# Altium schematic sheet SAMA7D65_DDR3L.SchDoc
size A3; SheetNumber: 9; SheetTotal: 23
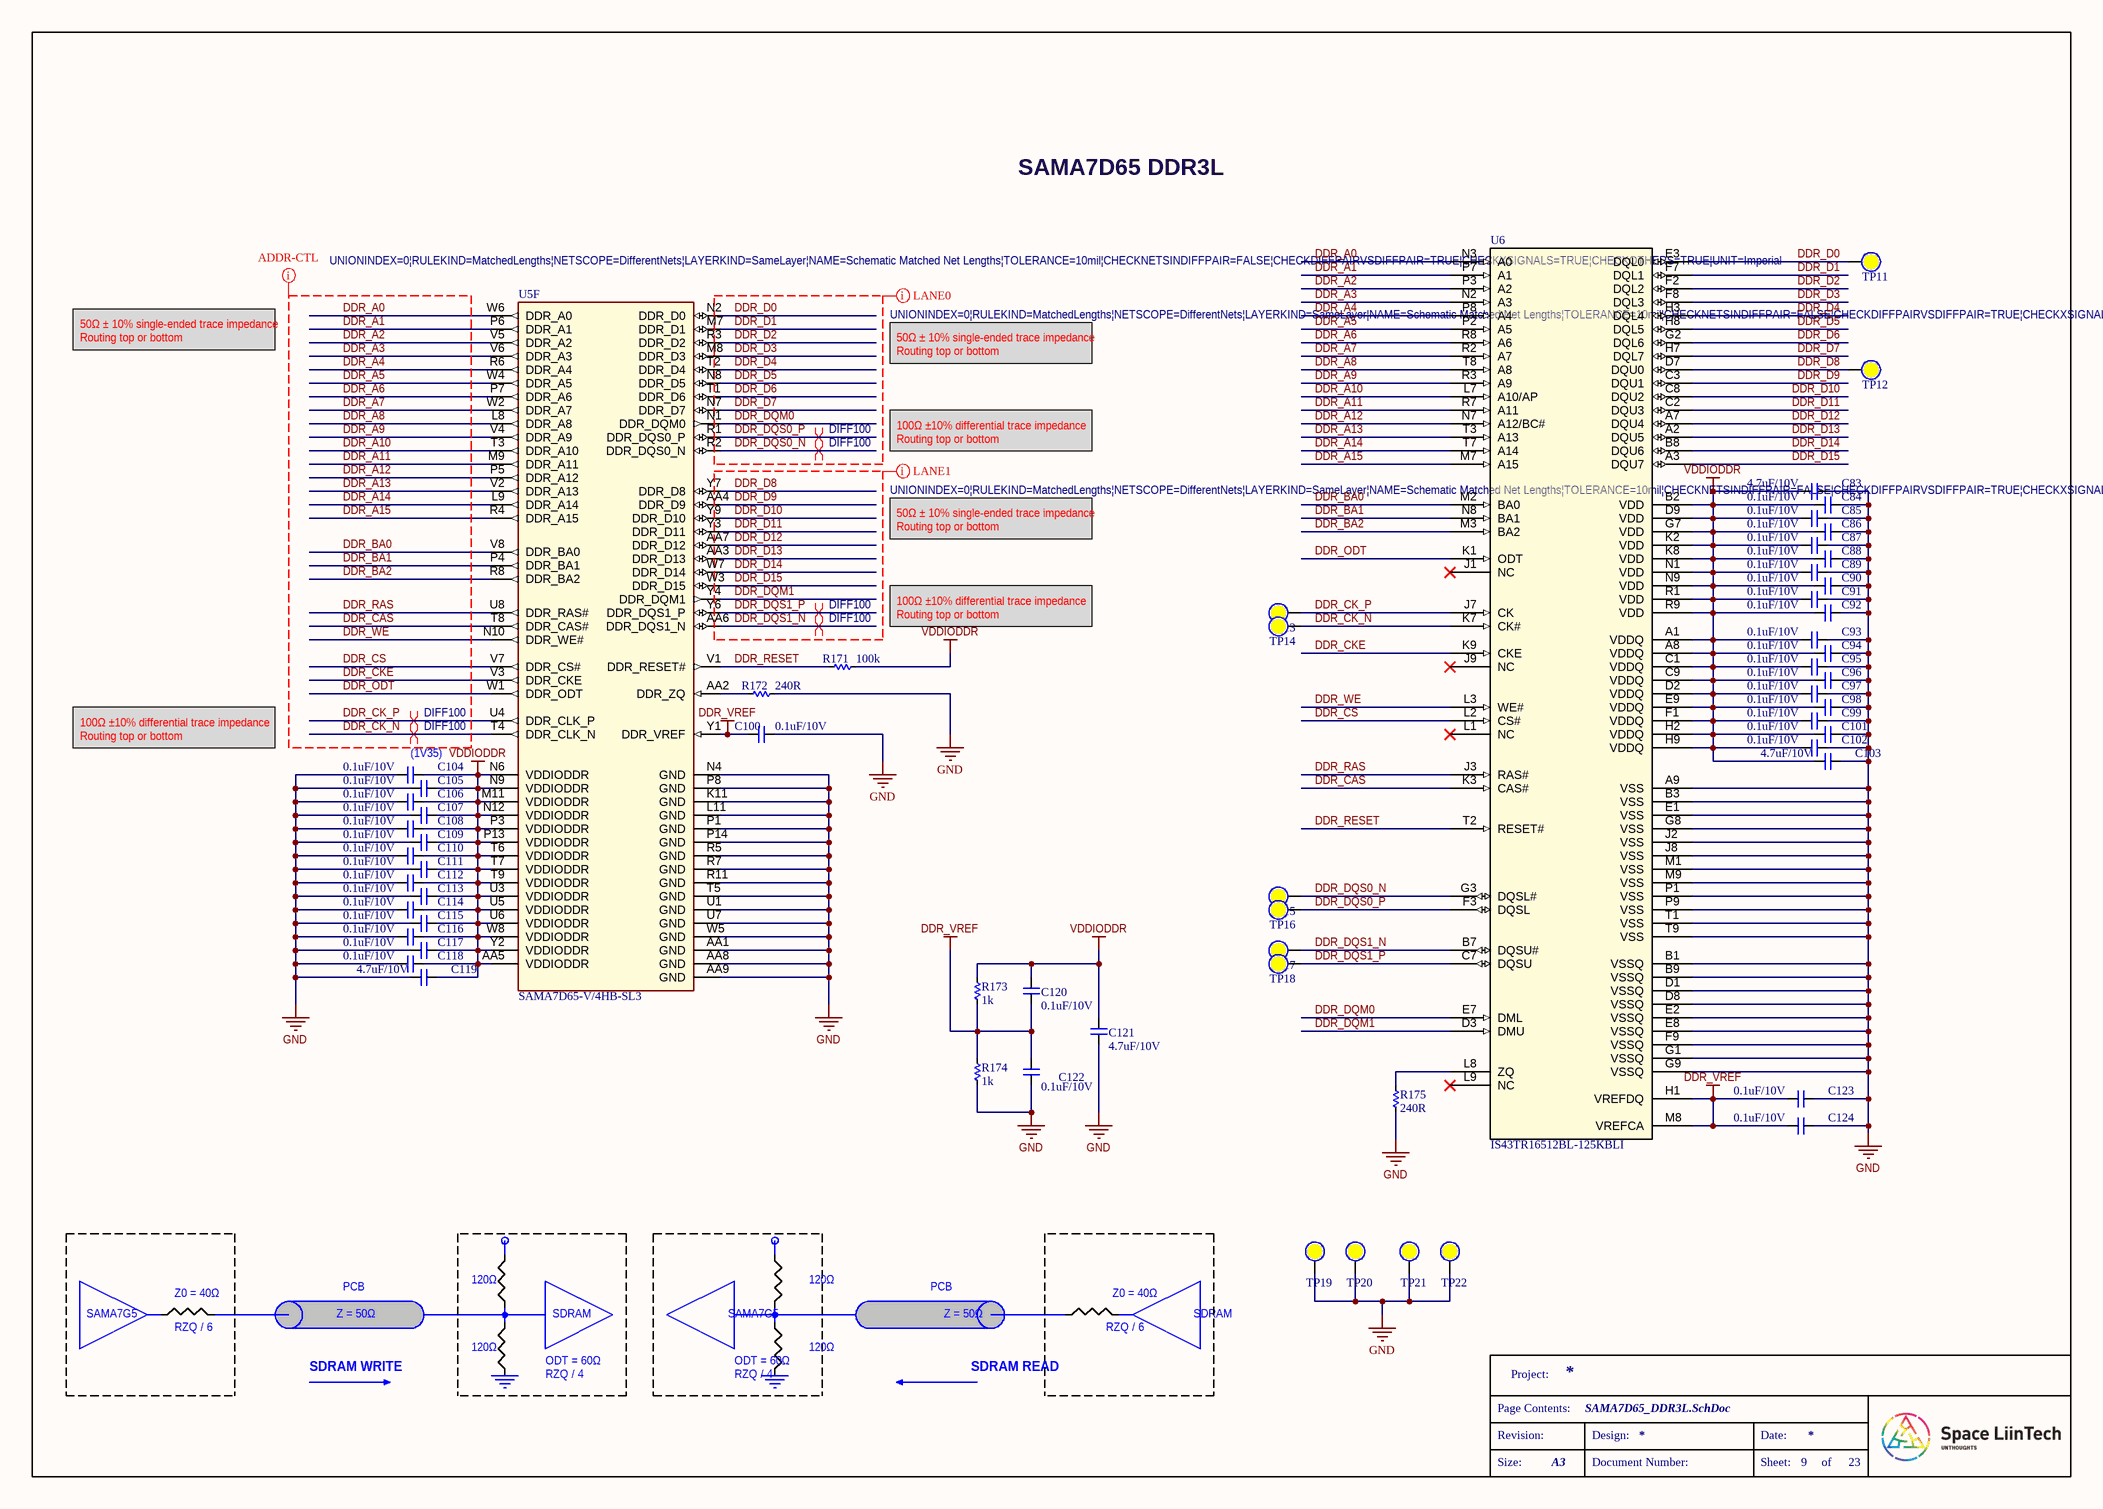
[diagram p0: SAMA7D65_DDR3L.SchDoc]

## Parts
C83  4.7uF/10V  [CAP_C_1005X50_L]
C84  0.1uF/10V  [CAP_C_0603x30]
C85  0.1uF/10V  [CAP_C_0603x30]
C86  0.1uF/10V  [CAP_C_0603x30]
C87  0.1uF/10V  [CAP_C_0603x30]
C88  0.1uF/10V  [CAP_C_0603x30]
C89  0.1uF/10V  [CAP_C_0603x30]
C90  0.1uF/10V  [CAP_C_0603x30]
C91  0.1uF/10V  [CAP_C_0603x30]
C92  0.1uF/10V  [CAP_C_0603x30]
C93  0.1uF/10V  [CAP_C_0603x30]
C94  0.1uF/10V  [CAP_C_0603x30]
C95  0.1uF/10V  [CAP_C_0603x30]
C96  0.1uF/10V  [CAP_C_0603x30]
C97  0.1uF/10V  [CAP_C_0603x30]
C98  0.1uF/10V  [CAP_C_0603x30]
C99  0.1uF/10V  [CAP_C_0603x30]
C100  0.1uF/10V  [CAP_C_0603x30]
C101  0.1uF/10V  [CAP_C_0603x30]
C102  0.1uF/10V  [CAP_C_0603x30]
C103  4.7uF/10V  [CAP_C_1005X50_L]
C104  0.1uF/10V  [CAP_C_0603x30]
C105  0.1uF/10V  [CAP_C_0603x30]
C106  0.1uF/10V  [CAP_C_0603x30]
C107  0.1uF/10V  [CAP_C_0603x30]
C108  0.1uF/10V  [CAP_C_0603x30]
C109  0.1uF/10V  [CAP_C_0603x30]
C110  0.1uF/10V  [CAP_C_0603x30]
C111  0.1uF/10V  [CAP_C_0603x30]
C112  0.1uF/10V  [CAP_C_0603x30]
C113  0.1uF/10V  [CAP_C_0603x30]
C114  0.1uF/10V  [CAP_C_0603x30]
C115  0.1uF/10V  [CAP_C_0603x30]
C116  0.1uF/10V  [CAP_C_0603x30]
C117  0.1uF/10V  [CAP_C_0603x30]
C118  0.1uF/10V  [CAP_C_0603x30]
C119  4.7uF/10V  [CAP_C_1005X50_L]
C120  0.1uF/10V  [CAP_C_0603x30]
C121  4.7uF/10V  [CAP_C_1005X50_L]
C122  0.1uF/10V  [CAP_C_0603x30]
C123  0.1uF/10V  [CAP_C_0603x30]
C124  0.1uF/10V  [CAP_C_0603x30]
R171  100k  [RES_C_1005x30_L]
R172  240R  [RES_C_0603X30]
R173  1k  [RES_C_1005x30_L]
R174  1k  [RES_C_1005x30_L]
R175  240R  [RES_C_0603X30]
TP11  (no value)  [Test point]  (no BOM)
TP12  (no value)  [Test point]  (no BOM)
TP13  (no value)  [Test point]  (no BOM)
TP14  (no value)  [Test point]  (no BOM)
TP15  (no value)  [Test point]  (no BOM)
TP16  (no value)  [Test point]  (no BOM)
TP17  (no value)  [Test point]  (no BOM)
TP18  (no value)  [Test point]  (no BOM)
TP19  (no value)  [Test point]  (no BOM)
TP20  (no value)  [Test point]  (no BOM)
TP21  (no value)  [Test point]  (no BOM)
TP22  (no value)  [Test point]  (no BOM)
U5  value SAMA7D65-V/4HB-SL3  [TFBGA-343_14x14]  (hidden comment: SAMA7D65)  (part F of 8)
U6  IS43TR16512BL-125KBLI  [TWBGA96_ISI]

## Nets
DDR_VREF: C100.1 C120.1 C122.2 C123.1 C124.1 R173.1 R174.2 U5.Y1(DDR_VREF) U6.H1(VREFDQ) U6.M8(VREFCA)
GND: C83.2 C84.2 C85.2 C86.2 C87.2 C88.2 C89.2 C90.2 C91.2 C92.2 C93.2 C94.2 C95.2 C96.2 C97.2 C98.2 C99.2 C100.2 C101.2 C102.2 C103.2 C104.1 C105.1 C106.1 C107.1 C108.1 C109.1 C110.1 C111.1 C112.1 C113.1 C114.1 C115.1 C116.1 C117.1 C118.1 C119.1 C121.1 C122.1 C123.2 C124.2 R172.2 R174.1 R175.1 TP19.0 TP20.0 TP21.0 TP22.0 U5.AA1(GND) U5.AA8(GND) U5.AA9(GND) U5.K11(GND) U5.L11(GND) U5.N4(GND) U5.P1(GND) U5.P8(GND) U5.P14(GND) U5.R5(GND) U5.R7(GND) U5.R11(GND) U5.T5(GND) U5.U1(GND) U5.U7(GND) U5.W5(GND) U6.A9(VSS) U6.B1(VSSQ) U6.B3(VSS) U6.B9(VSSQ) U6.D1(VSSQ) U6.D8(VSSQ) U6.E1(VSS) U6.E2(VSSQ) U6.E8(VSSQ) U6.F9(VSSQ) U6.G1(VSSQ) U6.G8(VSS) U6.G9(VSSQ) U6.J2(VSS) U6.J8(VSS) U6.M1(VSS) U6.M9(VSS) U6.P1(VSS) U6.P9(VSS) U6.T1(VSS) U6.T9(VSS)
VDDIODDR: C83.1 C84.1 C85.1 C86.1 C87.1 C88.1 C89.1 C90.1 C91.1 C92.1 C93.1 C94.1 C95.1 C96.1 C97.1 C98.1 C99.1 C101.1 C102.1 C103.1 C104.2 C105.2 C106.2 C107.2 C108.2 C109.2 C110.2 C111.2 C112.2 C113.2 C114.2 C115.2 C116.2 C117.2 C118.2 C119.2 C120.2 C121.2 R171.2 R173.2 U5.AA5(VDDIODDR) U5.M11(VDDIODDR) U5.N6(VDDIODDR) U5.N9(VDDIODDR) U5.N12(VDDIODDR) U5.P3(VDDIODDR) U5.P13(VDDIODDR) U5.T6(VDDIODDR) U5.T7(VDDIODDR) U5.T9(VDDIODDR) U5.U3(VDDIODDR) U5.U5(VDDIODDR) U5.U6(VDDIODDR) U5.W8(VDDIODDR) U5.Y2(VDDIODDR) U6.A1(VDDQ) U6.A8(VDDQ) U6.B2(VDD) U6.C1(VDDQ) U6.C9(VDDQ) U6.D2(VDDQ) U6.D9(VDD) U6.E9(VDDQ) U6.F1(VDDQ) U6.G7(VDD) U6.H2(VDDQ) U6.H9(VDDQ) U6.K2(VDD) U6.K8(VDD) U6.N1(VDD) U6.N9(VDD) U6.R1(VDD) U6.R9(VDD)
DDR_A0: U5.W6(DDR_A0) U6.N3(A0)
DDR_A1: U5.P6(DDR_A1) U6.P7(A1)
DDR_A2: U5.V5(DDR_A2) U6.P3(A2)
DDR_A3: U5.V6(DDR_A3) U6.N2(A3)
DDR_A4: U5.R6(DDR_A4) U6.P8(A4)
DDR_A5: U5.W4(DDR_A5) U6.P2(A5)
DDR_A6: U5.P7(DDR_A6) U6.R8(A6)
DDR_A7: U5.W2(DDR_A7) U6.R2(A7)
DDR_A8: U5.L8(DDR_A8) U6.T8(A8)
DDR_A9: U5.V4(DDR_A9) U6.R3(A9)
DDR_A10: U5.T3(DDR_A10) U6.L7(A10/AP)
DDR_A11: U5.M9(DDR_A11) U6.R7(A11)
DDR_A12: U5.P5(DDR_A12) U6.N7(A12/BC#)
DDR_A13: U5.V2(DDR_A13) U6.T3(A13)
DDR_A14: U5.L9(DDR_A14) U6.T7(A14)
DDR_A15: U5.R4(DDR_A15) U6.M7(A15)
DDR_BA0: U5.V8(DDR_BA0) U6.M2(BA0)
DDR_BA1: U5.P4(DDR_BA1) U6.N8(BA1)
DDR_BA2: U5.R8(DDR_BA2) U6.M3(BA2)
DDR_CAS: U5.T8(DDR_CAS#) U6.K3(CAS#)
DDR_CK_N: TP14.0 U5.T4(DDR_CLK_N) U6.K7(CK#)
DDR_CK_P: TP13.0 U5.U4(DDR_CLK_P) U6.J7(CK)
DDR_CKE: U5.V3(DDR_CKE) U6.K9(CKE)
DDR_CS: U5.V7(DDR_CS#) U6.L2(CS#)
DDR_D0: TP11.0 U5.N2(DDR_D0) U6.E3(DQL0)
DDR_D1: U5.M7(DDR_D1) U6.F7(DQL1)
DDR_D2: U5.R3(DDR_D2) U6.F2(DQL2)
DDR_D3: U5.M8(DDR_D3) U6.F8(DQL3)
DDR_D4: U5.T2(DDR_D4) U6.H3(DQL4)
DDR_D5: U5.N8(DDR_D5) U6.H8(DQL5)
DDR_D6: U5.T1(DDR_D6) U6.G2(DQL6)
DDR_D7: U5.N7(DDR_D7) U6.H7(DQL7)
DDR_D8: TP12.0 U5.Y7(DDR_D8) U6.D7(DQU0)
DDR_D9: U5.AA4(DDR_D9) U6.C3(DQU1)
DDR_D10: U5.Y9(DDR_D10) U6.C8(DQU2)
DDR_D11: U5.Y3(DDR_D11) U6.C2(DQU3)
DDR_D12: U5.AA7(DDR_D12) U6.A7(DQU4)
DDR_D13: U5.AA3(DDR_D13) U6.A2(DQU5)
DDR_D14: U5.W7(DDR_D14) U6.B8(DQU6)
DDR_D15: U5.W3(DDR_D15) U6.A3(DQU7)
DDR_DQM0: U5.N1(DDR_DQM0) U6.E7(DML)
DDR_DQM1: U5.Y4(DDR_DQM1) U6.D3(DMU)
DDR_DQS0_N: TP15.0 U5.R2(DDR_DQS0_N) U6.G3(DQSL#)
DDR_DQS0_P: TP16.0 U5.R1(DDR_DQS0_P) U6.F3(DQSL)
DDR_DQS1_N: TP17.0 U5.AA6(DDR_DQS1_N) U6.B7(DQSU#)
DDR_DQS1_P: TP18.0 U5.Y6(DDR_DQS1_P) U6.C7(DQSU)
DDR_ODT: U5.W1(DDR_ODT) U6.K1(ODT)
DDR_RAS: U5.U8(DDR_RAS#) U6.J3(RAS#)
DDR_RESET: R171.1 U5.V1(DDR_RESET#) U6.T2(RESET#)
DDR_WE: U5.N10(DDR_WE#) U6.L3(WE#)
NetR172_1: R172.1 U5.AA2(DDR_ZQ)
NetR175_2: R175.2 U6.L8(ZQ)

Not connected (* = marked no-connect by the designer): U6 J1(NC)* J9(NC)* L1(NC)* L9(NC)*

## Layout directives
net class DDR-ADDR-CTL; rule Matched Net Lengths [Tolerance = 10mil]: DDR_A0, DDR_A1, DDR_A2, DDR_A3, DDR_A4, DDR_A5, DDR_A6, DDR_A7, DDR_A8, DDR_A9, DDR_A10, DDR_A11, DDR_A12, DDR_A13, DDR_A14, DDR_A15, DDR_BA0, DDR_BA1, DDR_BA2, DDR_CAS, DDR_CK_N, DDR_CK_P, DDR_CKE, DDR_CS, DDR_ODT, DDR_RAS, DDR_WE
differential pair; differential pair class DIFF100; net class DIFF100; rule Matched Net Lengths [Tolerance = 4mil]: DDR_CK_N, DDR_CK_P, DDR_DQS0_N, DDR_DQS0_P, DDR_DQS1_N, DDR_DQS1_P
net class DDR-LANE0; rule Matched Net Lengths [Tolerance = 10mil]: DDR_D0, DDR_D1, DDR_D2, DDR_D3, DDR_D4, DDR_D5, DDR_D6, DDR_D7, DDR_DQM0, DDR_DQS0_N, DDR_DQS0_P
net class DDR-LANE1; rule Matched Net Lengths [Tolerance = 10mil]: DDR_D8, DDR_D9, DDR_D10, DDR_D11, DDR_D12, DDR_D13, DDR_D14, DDR_D15, DDR_DQM1, DDR_DQS1_N, DDR_DQS1_P

## Notes on the sheet
- SAMA7D65 DDR3L
- 50Ω ± 10% single-ended trace impedance
  Routing top or bottom
- 100Ω ±10% differential trace impedance
  Routing top or bottom
- (near C104) (1V35)
- SAMA7G5
- Z0 = 40Ω
- Z = 50Ω
- PCB
- 120Ω
- SDRAM
- RZQ / 6
- SDRAM WRITE
- ODT = 60Ω
- RZQ / 4
- SDRAM READ
- Project:
- Page Contents:
- Revision:
- Design:
- Date:
- Size:
- A3
- Document Number:
- Sheet:
- of

## Library data of the parts
C83-C124 = _CAP_C_2: CAP CHIP
R171-R175 = _RES_B_2: RES
TP11-TP22 = Test Point: Solder: NF
U5 = SAMA7D65: SAMA7D65 MPU 1000MHz Cortex-A7 TFBGA-343; Manufacturer 1: Microchip Technology; Description_: MCHP MPU 32-BIT Cortex-A7 1000MHz 128kB SAMA7D65-V/4HB-SL3 TFBGA-343; Populated: YES; MCHP-ID: IC2674; Symbol: SAMA7D65-TFBGA-343; Dev Tools Status: Design; Owner: Ciprian Abramov; Restricted Sourcing: No; Manufacturer Part Number 1: SAMA7D65-V/4HB-SL3; Type: 32-Bit MPU; Status: MCL Design; Revision: 1; Category: MCHP-Microcontroller; ComponentLink1URL: https://www.microchip.com/sitesearch/search/Product%20and%20Development%20Tools/SAMA7D65-V/4HB-SL3; ComponentLink1Description: SVN Datasheet; ComponentLink2Description: Local Datasheet; ComponentLink3URL: C:\ALTIUM_WORK\00001_MCHP-CDB\Library\LibraryRefs\SAMA7D65-TFBGA-343.SchLib; ComponentLink3Description: Open Symbol; ComponentLink4URL: C:\ALTIUM_WORK\00001_MCHP-CDB\Library\Footprints\TFBGA-343_14x14.PcbLib; ComponentLink4Description: Open Footprint; ComponentLink5Description: Open Footprint 2; ComponentLink6Description: Open Footprint 3; ComponentLink7Description: Open Footprint 4; Supplier 1: Microchip Technology; Supplier Part Number 1: SAMA7D65-V/4HB-SL3; Operating Temperature: -40C to +105C; Quantity Override: 1
U6 = IC_RAM_IS43TR16512BL-125KBLI: DDR3L; Manufacturer_Name: ISSI; Copyright: Copyright (C) 2025 Ultra Librarian. All rights reserved.; Manufacturer_Part_Number: IS43TR16512BL-125KBLI; RefDes: RefDes; Type: Type